# Altium schematic sheet 控制部分.SchDoc
size A4
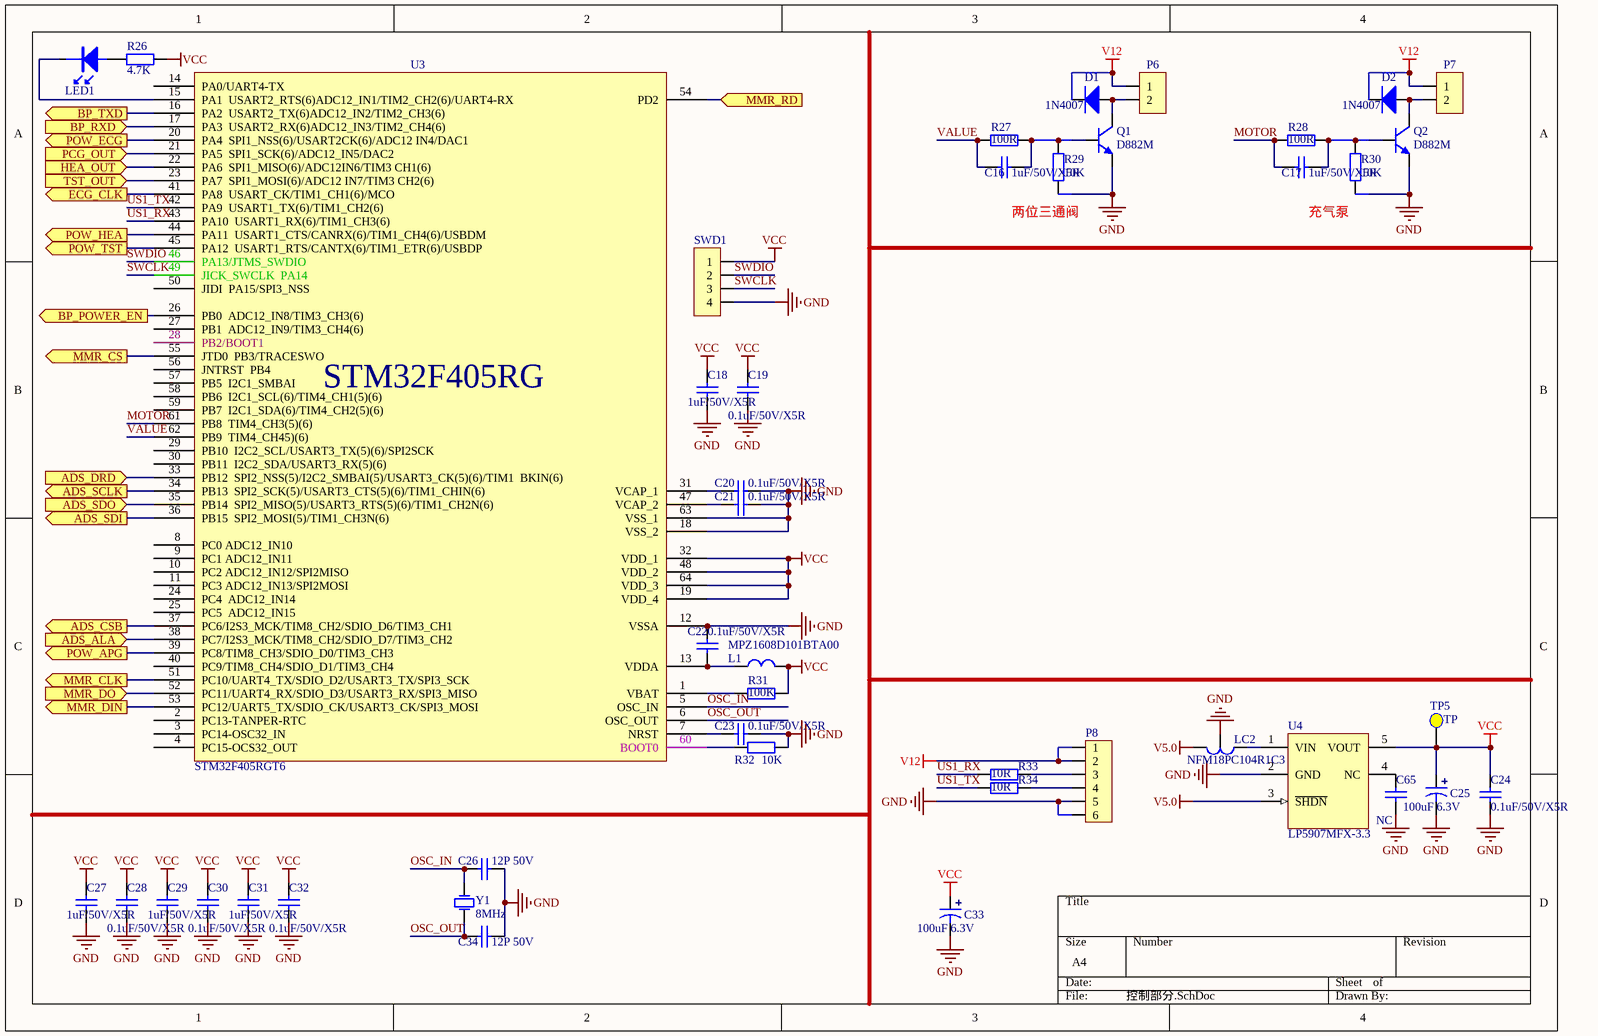
[diagram p0: 控制部分.SchDoc]

## Parts
C16  1uF/50V/X5R  [SMD-0603C]
C17  1uF/50V/X5R  [SMD-0603C]
C18  1uF/50V/X5R  [SMD-0603C]
C19  0.1uF/50V/X5R  [SMD-0603C]
C20  0.1uF/50V/X5R  [SMD-0603C]
C21  0.1uF/50V/X5R  [SMD-0603C]
C22  0.1uF/50V/X5R  [SMD-0603C]
C23  0.1uF/50V/X5R  [SMD-0603C]
C24  0.1uF/50V/X5R  [SMD-0603C]
C25  100uF 6.3V  [SMD-3528-B]
C26  12P 50V  [SMD-0603C]
C27  1uF/50V/X5R  [SMD-0603C]
C28  0.1uF/50V/X5R  [SMD-0603C]
C29  1uF/50V/X5R  [SMD-0603C]
C30  0.1uF/50V/X5R  [SMD-0603C]
C31  1uF/50V/X5R  [SMD-0603C]
C32  0.1uF/50V/X5R  [SMD-0603C]
C33  100uF 6.3V  [SMD-3528-B]
C34  12P 50V  [SMD-0603C]
C65  NC  [SMD-0603C]
D1  1N4007  [DO-214-AC]
D2  1N4007  [DO-214-AC]
L1  MPZ1608D101BTA00  [SMD-0603]
LC2  NFM18PC104R1C3  [NFM18P-0603]
LED1  蓝  [SMD-0603D]  (value not drawn)
P6  VH2.54-2P  [XH-2.54-2P-LI]  (value not drawn)
P7  VH2.54-2P  [XH-2.54-2P-LI]  (value not drawn)
P8  XH2.54 6P 立贴  [XH-2.54-6P-LI]  (value not drawn)
Q1  D882M  [SOT-89-3]
Q2  D882M  [SOT-89-3]
R26  4.7K  [SMD-0603]
R27  100R  [SMD-0603]
R28  100R  [SMD-0603]
R29  10K  [SMD-0603]
R30  10K  [SMD-0603]
R31  100K  [SMD-0603]
R32  10K  [SMD-0603]
R33  10R  [SMD-0603]
R34  10R  [SMD-0603]
SWD1  SIP-4  [SIP-4]  (value not drawn)
TP5  TP  [TP]
U3  STM32F405RGT6  [LQFP64_N]
U4  LP5907MFX-3.3  [SOT23-5]
Y1  8MHz  [XTAL-3225-2]

## Ports
ADS_ALA (in), ADS_CSB (out), ADS_DRD (in), ADS_SCLK (out), ADS_SDI (out), ADS_SDO (in), BP_POWER_EN (out), BP_RXD (in), BP_TXD (out), ECG_CLK (out), HEA_OUT (in), MMR_CLK (out), MMR_CS (out), MMR_DIN (out), MMR_DO (in), MMR_RD (in), PCG_OUT (in), POW_APG (out), POW_ECG (out), POW_HEA (out), POW_TST (out), TST_OUT (in)

## Nets
GND: C18.1 C19.1 C20.1 C21.1 C22.1 C23.2 C24.1 C25.2 C26.1 C27.1 C28.1 C29.1 C30.1 C31.1 C32.1 C33.2 C34.1 C65.1 LC2.2 P8.5 P8.6 Q1.3(E) Q2.3(E) R29.2 R30.2 R32.2 SWD1.4 U3.12(VSSA) U3.18(VSS_2) U3.63(VSS_1) U4.2(GND)
V5.0: LC2.3 U4.3(~{SHDN})
V12: D1.2(K) D2.2(K) P6.1 P7.1 P8.1 P8.2
VCC: C18.2 C19.2 C24.2 C25.1 C27.2 C28.2 C29.2 C30.2 C31.2 C32.2 C33.1 L1.2 R26.1 R31.1 SWD1.1 TP5.1(TP) U3.19(VDD_4) U3.32(VDD_1) U3.48(VDD_2) U3.64(VDD_3) U4.5(VOUT)
ADS_ALA: U3.38(PC7/I2S3_MCK/TIM8_CH2/SDIO_D7/TIM3_CH2) ; port ADS_ALA
ADS_CSB: U3.37(PC6/I2S3_MCK/TIM8_CH2/SDIO_D6/TIM3_CH1) ; port ADS_CSB
ADS_DRD: U3.33(PB12__SPI2_NSS(5)/I2C2_SMBAI(5)/USART3_CK(5)(6)/TIM1__BKIN(6)) ; port ADS_DRD
ADS_SCLK: U3.34(PB13__SPI2_SCK(5)/USART3_CTS(5)(6)/TIM1_CHIN(6)) ; port ADS_SCLK
ADS_SDI: U3.36(PB15__SPI2_MOSI(5)/TIM1_CH3N(6)) ; port ADS_SDI
ADS_SDO: U3.35(PB14__SPI2_MISO(5)/USART3_RTS(5)(6)/TIM1_CH2N(6)) ; port ADS_SDO
BP_POWER_EN: U3.26(PB0__ADC12_IN8/TIM3_CH3(6)) ; port BP_POWER_EN
BP_RXD: U3.17(PA3__USART2_RX(6)ADC12_IN3/TIM2_CH4(6)) ; port BP_RXD
BP_TXD: U3.16(PA2__USART2_TX(6)ADC12_IN2/TIM2_CH3(6)) ; port BP_TXD
ECG_CLK: U3.41(PA8__USART_CK/TIM1_CH1(6)/MCO) ; port ECG_CLK
HEA_OUT: U3.22(PA6__SPI1_MISO(6)/ADC12IN6/TIM3_CH1(6)) ; port HEA_OUT
MMR_CLK: U3.51(PC10/UART4_TX/SDIO_D2/USART3_TX/SPI3_SCK) ; port MMR_CLK
MMR_CS: U3.55(JTD0__PB3/TRACESWO) ; port MMR_CS
MMR_DIN: U3.53(PC12/UART5_TX/SDIO_CK/USART3_CK/SPI3_MOSI) ; port MMR_DIN
MMR_DO: U3.52(PC11/UART4_RX/SDIO_D3/USART3_RX/SPI3_MISO) ; port MMR_DO
MMR_RD: U3.54(PD2) ; port MMR_RD
MOTOR: C17.2 R28.2 U3.61(PB8__TIM4_CH3(5)(6))
OSC_IN: C26.2 U3.5(OSC_IN) Y1.2(OSC2)
OSC_OUT: C34.2 U3.6(OSC_OUT) Y1.1(OSC1)
PCG_OUT: U3.21(PA5__SPI1_SCK(6)/ADC12_IN5/DAC2) ; port PCG_OUT
POW_APG: U3.39(PC8/TIM8_CH3/SDIO_D0/TIM3_CH3) ; port POW_APG
POW_ECG: U3.20(PA4__SPI1_NSS(6)/USART2CK(6)/ADC12_IN4/DAC1) ; port POW_ECG
POW_HEA: U3.44(PA11__USART1_CTS/CANRX(6)/TIM1_CH4(6)/USBDM) ; port POW_HEA
POW_TST: U3.45(PA12__USART1_RTS/CANTX(6)/TIM1_ETR(6)/USBDP) ; port POW_TST
SWCLK: SWD1.3 U3.49(JICK_SWCLK__PA14)
SWDIO: SWD1.2 U3.46(PA13/JTMS_SWDIO)
TST_OUT: U3.23(PA7__SPI1_MOSI(6)/ADC12_IN7/TIM3_CH2(6)) ; port TST_OUT
US1_RX: R33.2 U3.43(PA10__USART1_RX(6)/TIM1_CH3(6))
US1_TX: R34.2 U3.42(PA9__USART1_TX(6)/TIM1_CH2(6))
VALUE: C16.2 R27.2 U3.62(PB9__TIM4_CH45)(6))
NetC16_1: C16.1 Q1.1(B) R27.1 R29.1
NetC17_1: C17.1 Q2.1(B) R28.1 R30.1
NetC20_2: C20.2 U3.31(VCAP_1)
NetC21_2: C21.2 U3.47(VCAP_2)
NetC22_2: C22.2 L1.1 U3.13(VDDA)
NetC23_1: C23.1 U3.7(NRST)
NetC65_2: C65.2 U4.4(NC)
NetD1_1: D1.1(A) P6.2 Q1.2(C)
NetD2_1: D2.1(A) P7.2 Q2.2(C)
NetLC2_1: LC2.1 U4.1(VIN)
NetLED1_1: LED1.1 R26.2
NetLED1_2: LED1.2 U3.15(PA1__USART2_RTS(6)ADC12_IN1/TIM2_CH2(6)/UART4-RX)
NetP8_3: P8.3 R33.1
NetP8_4: P8.4 R34.1
NetR31_2: R31.2 U3.1(VBAT)
NetR32_1: R32.1 U3.60(BOOT0)

Not connected (* = marked no-connect by the designer): U3 2(PC13-TANPER-RTC) 3(PC14-OSC32_IN) 4(PC15-OCS32_OUT) 8(PC0_ADC12_IN10) 9(PC1_ADC12_IN11) 10(PC2_ADC12_IN12/SPI2MISO) 11(PC3_ADC12_IN13/SPI2MOSI) 14(PA0/UART4-TX) 24(PC4__ADC12_IN14) 25(PC5__ADC12_IN15) 27(PB1__ADC12_IN9/TIM3_CH4(6)) 28(PB2/BOOT1) 29(PB10__I2C2_SCL/USART3_TX(5)(6)/SPI2SCK) 30(PB11__I2C2_SDA/USART3_RX(5)(6)) 40(PC9/TIM8_CH4/SDIO_D1/TIM3_CH4) 50(JIDI__PA15/SPI3_NSS) 56(JNTRST__PB4) 57(PB5__I2C1_SMBAI) 58(PB6__I2C1_SCL(6)/TIM4_CH1(5)(6)) 59(PB7__I2C1_SDA(6)/TIM4_CH2(5)(6))

## Notes on the sheet
- 两位三通阀
- 充气泵

## Library data of the parts
C16-C23 C26-C32 C34 = CAP4: 贴片电容 20%
C24 = CAP4: 贴片电容
C25 C33 = CAP2: 钽电容
C65 = CAP4: 贴片电容 10%
D1 D2 = DIODE2: 二极管 M7
L1 = CIZHU1: 磁珠电感 100R 100MHz
LC2 = SMD-EMIFIL-0603: LC滤波器
LED1 = LED0: LED
P6 P7 = SIP-2: 2.54mm- 2P立贴
P8 = SIP-6: 血压计接口
Q1 Q2 = NPN-TO252: NPN TO252
R26 = RES2: 贴片电阻
R27-R30 = RES-SOP: 贴片电阻 5%
R31-R34 = RES2: 贴片电阻 5%
TP5 = TP_POINT
U3 = STM32F405RG: MCU
U4 = MCP1802: LDO
Y1 = XTAL: 晶振